# Altium schematic sheet Sensing.SchDoc
size A
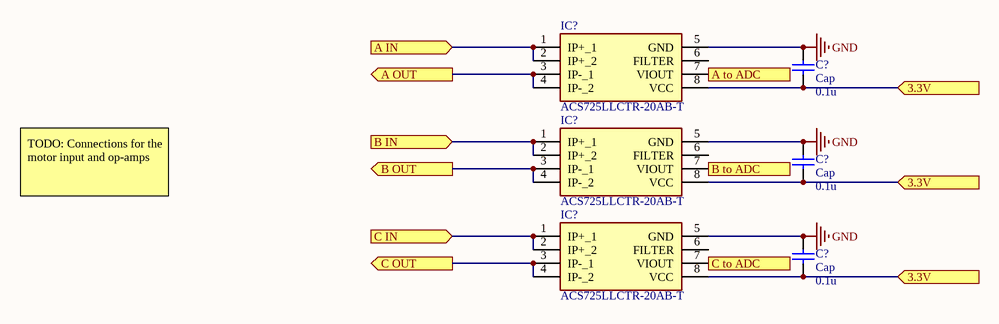
[diagram p0: Sensing.SchDoc]

## Parts
(Parts that share a designator on the sheet are numbered #1, #2 ... from top to bottom, then left to right.)
C?#1  Cap  value 0.1u  [RAD-0.3]
C?#2  Cap  value 0.1u  [RAD-0.3]
C?#3  Cap  value 0.1u  [RAD-0.3]
IC?#1  ACS725LLCTR-20AB-T  [SOT127P600X175-8N]
IC?#2  ACS725LLCTR-20AB-T  [SOT127P600X175-8N]
IC?#3  ACS725LLCTR-20AB-T  [SOT127P600X175-8N]

## Ports
3.3V (in), A IN (in), A OUT (out), A to ADC (out), B IN (in), B OUT (out), B to ADC (out), C IN (in), C OUT (out), C to ADC (out)

## Nets
GND: C?#1.2 C?#2.2 C?#3.2 IC?#1.5(GND) IC?#2.5(GND) IC?#3.5(GND)
3.3V: C?#1.1 C?#2.1 C?#3.1 IC?#1.8(VCC) IC?#2.8(VCC) IC?#3.8(VCC) ; port 3.3V
A IN: IC?#1.1(IP+_1) IC?#1.2(IP+_2) ; port A IN
A OUT: IC?#1.3(IP-_1) IC?#1.4(IP-_2) ; port A OUT
A to ADC: IC?#1.7(VIOUT) ; port A to ADC
B IN: IC?#2.1(IP+_1) IC?#2.2(IP+_2) ; port B IN
B OUT: IC?#2.3(IP-_1) IC?#2.4(IP-_2) ; port B OUT
B to ADC: IC?#2.7(VIOUT) ; port B to ADC
C IN: IC?#3.1(IP+_1) IC?#3.2(IP+_2) ; port C IN
C OUT: IC?#3.3(IP-_1) IC?#3.4(IP-_2) ; port C OUT
C to ADC: IC?#3.7(VIOUT) ; port C to ADC

Not connected (* = marked no-connect by the designer): IC?#1 6(FILTER); IC?#2 6(FILTER); IC?#3 6(FILTER)

## Notes on the sheet
- TODO: Connections for the motor input and op-amps

## Library data of the parts
C?#1-C?#3 = Cap: Capacitor; Published: 8-Jun-2000; LatestRevisionDate: 17-Jul-2002; LatestRevisionNote: Re-released for DXP Platform.; PackageReference: RAD-0.3; Publisher: Altium Limited; PackageDescription: Radial Cap, Thru-Hole; 2 Leads; 0.3 in Pin Spacing
IC?#1-IC?#3 = ACS725LLCTR-20AB-T: Integrated Circuit; Manufacturer_Name: Allegro Microsystems; Datasheet Link: https://www.allegromicro.com/~/media/Files/Datasheets/ACS725-Datasheet.ashx; Height: 1.75mm; Manufacturer_Part_Number: ACS725LLCTR-20AB-T